# Altium schematic sheet MCU.SchDoc
size D; SheetNumber: 4; SheetTotal: 7
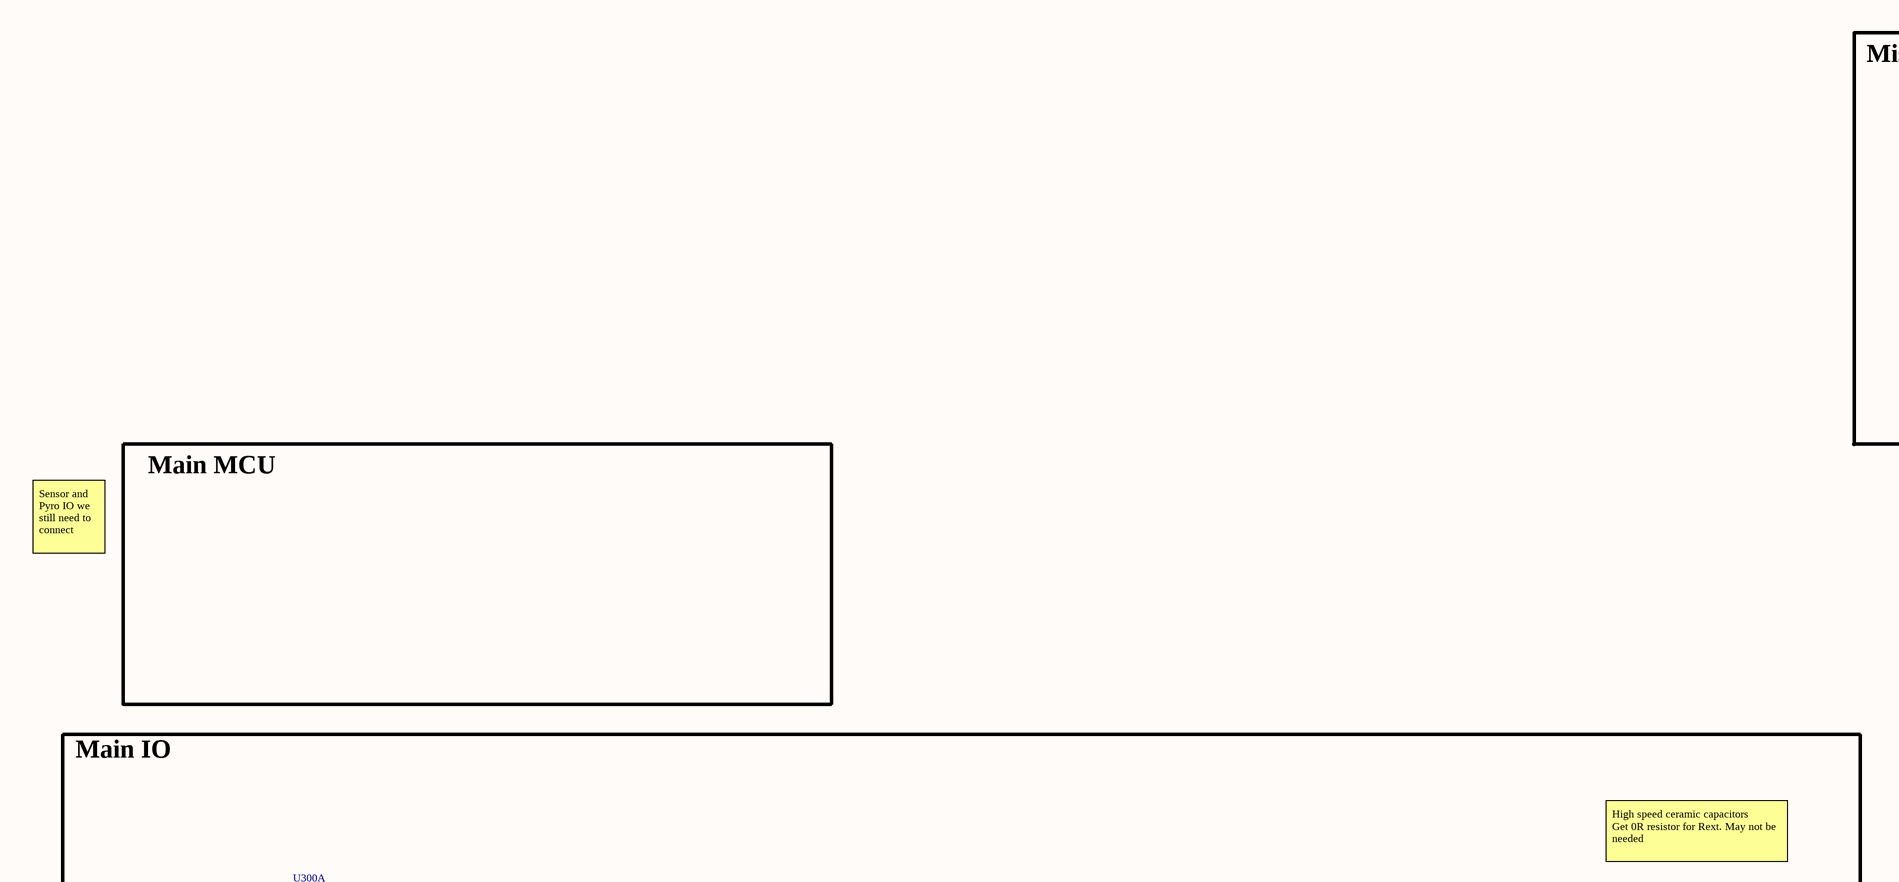
[diagram p0: MCU.SchDoc, top left]
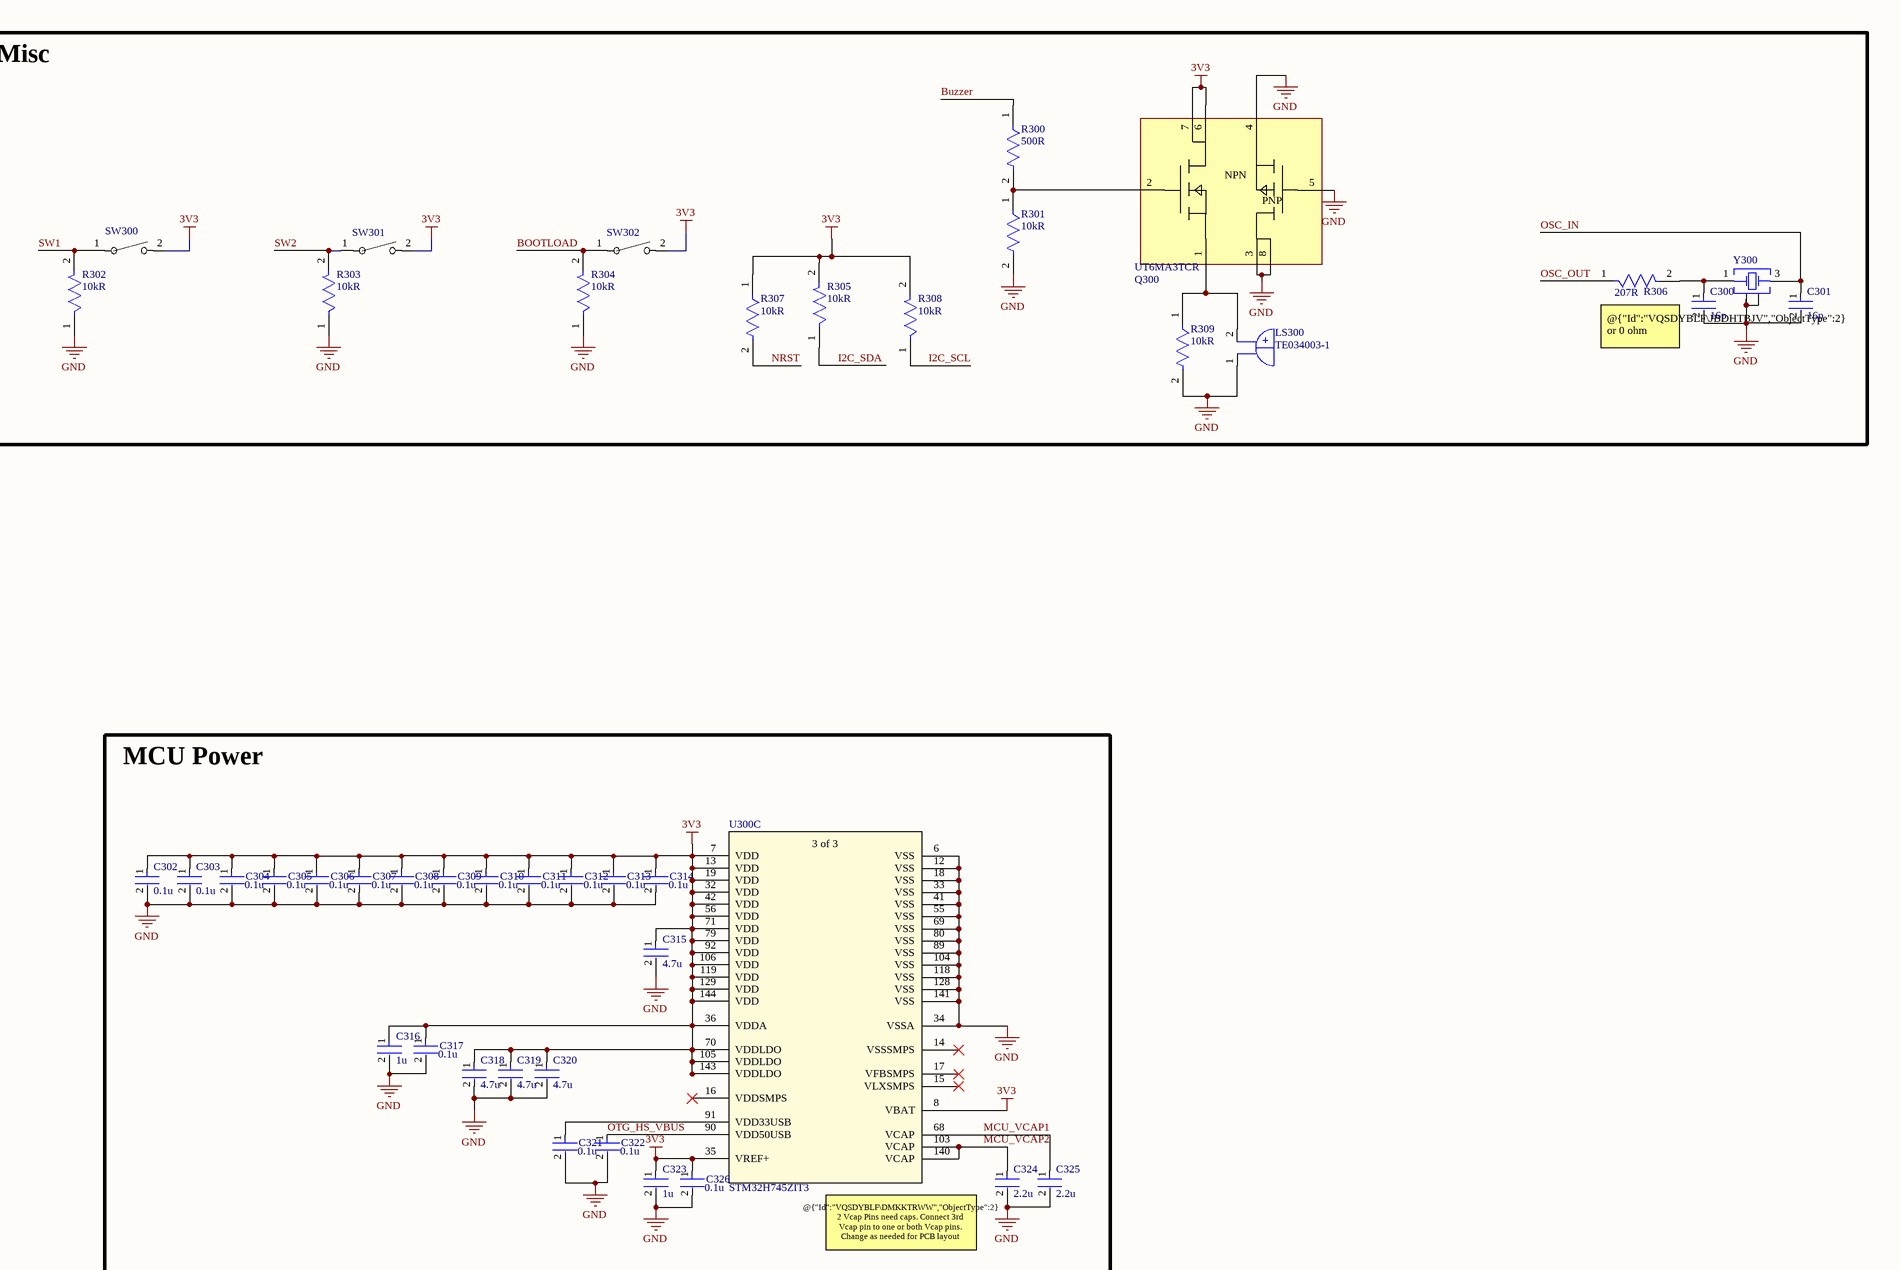
[diagram p1: MCU.SchDoc, top right]
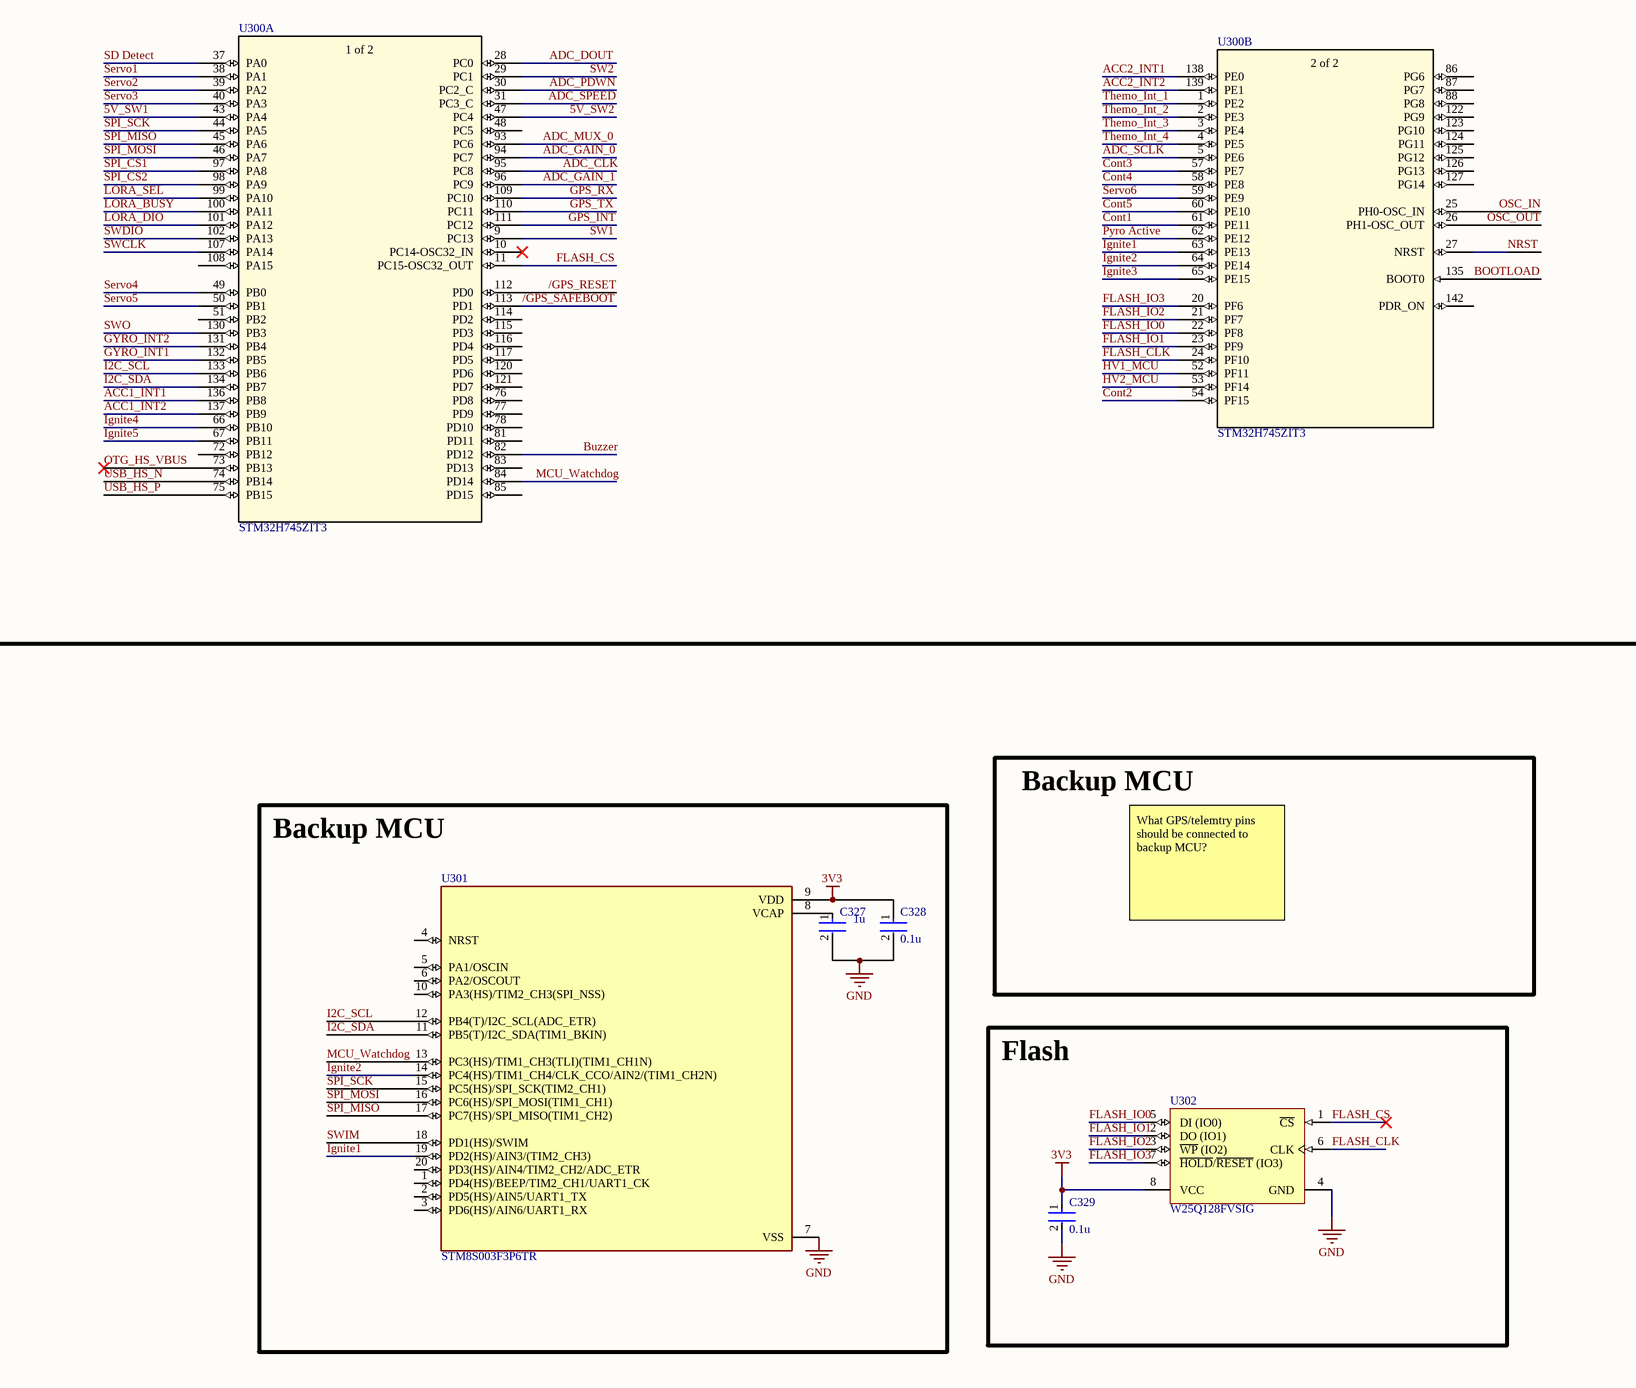
[diagram p2: MCU.SchDoc, bottom left]

## Parts
C300  Capacitance: 16p  [FP-CL10-IPC_A]  (hidden comment: CL10C681JB8NFNC)
C301  Capacitance: 16p  [FP-CL10-IPC_A]  (hidden comment: CL10C681JB8NFNC)
C302  Capacitance: 0.1u  [FP-CL94-IPC_C]  (hidden comment: CL05B104KQ5NNNC)
C303  Capacitance: 0.1u  [FP-CL94-IPC_C]  (hidden comment: CL05B104KQ5NNNC)
C304  Capacitance: 0.1u  [FP-CL94-IPC_C]  (hidden comment: CL05B104KQ5NNNC)
C305  Capacitance: 0.1u  [FP-CL94-IPC_C]  (hidden comment: CL05B104KQ5NNNC)
C306  Capacitance: 0.1u  [FP-CL94-IPC_C]  (hidden comment: CL05B104KQ5NNNC)
C307  Capacitance: 0.1u  [FP-CL94-IPC_C]  (hidden comment: CL05B104KQ5NNNC)
C308  Capacitance: 0.1u  [FP-CL94-IPC_C]  (hidden comment: CL05B104KQ5NNNC)
C309  Capacitance: 0.1u  [FP-CL94-IPC_C]  (hidden comment: CL05B104KQ5NNNC)
C310  Capacitance: 0.1u  [FP-CL94-IPC_C]  (hidden comment: CL05B104KQ5NNNC)
C311  Capacitance: 0.1u  [FP-CL94-IPC_C]  (hidden comment: CL05B104KQ5NNNC)
C312  Capacitance: 0.1u  [FP-CL94-IPC_C]  (hidden comment: CL05B104KQ5NNNC)
C313  Capacitance: 0.1u  [FP-CL94-IPC_C]  (hidden comment: CL05B104KQ5NNNC)
C314  Capacitance: 0.1u  [FP-CL94-IPC_C]  (hidden comment: CL05B104KQ5NNNC)
C315  Capacitance: 4.7u  [FP-CL10-IPC_A]  (hidden comment: CL10C681JB8NFNC)
C316  Capacitance: 1u  [FP-CL10-IPC_A]  (hidden comment: CL10C681JB8NFNC)
C317  Capacitance: 0.1u  [FP-CL94-IPC_C]  (hidden comment: CL05B104KQ5NNNC)
C318  Capacitance: 4.7u  [FP-CL10-IPC_A]  (hidden comment: CL10C681JB8NFNC)
C319  Capacitance: 4.7u  [FP-CL10-IPC_A]  (hidden comment: CL10C681JB8NFNC)
C320  Capacitance: 4.7u  [FP-CL10-IPC_A]  (hidden comment: CL10C681JB8NFNC)
C321  Capacitance: 0.1u  [FP-CL94-IPC_C]  (hidden comment: CL05B104KQ5NNNC)
C322  Capacitance: 0.1u  [FP-CL94-IPC_C]  (hidden comment: CL05B104KQ5NNNC)
C323  Capacitance: 1u  [FP-CL10-IPC_A]  (hidden comment: CL10C681JB8NFNC)
C324  Capacitance: 2.2u  [FP-CL10-IPC_A]  (hidden comment: CL10C681JB8NFNC)
C325  Capacitance: 2.2u  [FP-CL10-IPC_A]  (hidden comment: CL10C681JB8NFNC)
C326  Capacitance: 0.1u  [FP-CL94-IPC_C]  (hidden comment: CL05B104KQ5NNNC)
C327  Capacitance: 1u  [FP-CL10-IPC_A]  (hidden comment: CL10C681JB8NFNC)
C328  Capacitance: 0.1u  [FP-CL10-IPC_A]  (hidden comment: CL10C681JB8NFNC)
C329  Capacitance: 0.1u  [FP-CL10-IPC_A]  (hidden comment: CL10C681JB8NFNC)
LS300  TE034003-1  [XDCR_TE034003-1]
Q300  UT6MA3TCR  [TRANS_UT6J3_ROM]
R300  value 500R  [FP-CPF0603-MFG]  (hidden comment: CPF0603B2K15E1)
R301  value 10kR  [FP-CPF0603-MFG]  (hidden comment: CPF0603B2K15E1)
R302  value 10kR  [FP-CPF0603-MFG]  (hidden comment: CPF0603B2K15E1)
R303  value 10kR  [FP-CPF0603-MFG]  (hidden comment: CPF0603B2K15E1)
R304  value 10kR  [FP-CPF0603-MFG]  (hidden comment: CPF0603B2K15E1)
R305  value 10kR  [FP-CPF0603-MFG]  (hidden comment: CPF0603B2K15E1)
R306  value 207R  [FP-CPF0603-MFG]  (hidden comment: CPF0603B2K15E1)
R307  value 10kR  [FP-CPF0603-MFG]  (hidden comment: CPF0603B2K15E1)
R308  value 10kR  [FP-CPF0603-MFG]  (hidden comment: CPF0603B2K15E1)
R309  value 10kR  [FP-CPF0603-MFG]  (hidden comment: CPF0603B2K15E1)
SW300  PTS636SL43SMTRLFS  [SW_PTS636S-J_CNK]  (value not drawn)
SW301  PTS636SL43SMTRLFS  [SW_PTS636S-J_CNK]  (value not drawn)
SW302  PTS636SL43SMTRLFS  [SW_PTS636S-J_CNK]  (value not drawn)
U300  STM32H745ZIT3  [LQFP-144]  (parts A,B,C of 3)
U301  STM8S003F3P6TR  [SOP65P640X120-20N]
U302  W25Q128FVSIG  [WINB-SOIC-8_M]
Y300  830108213509  [WE-XTAL_IQXC-42]  (value not drawn)

## Blocks framed on the sheet
Misc: C300 C301 LS300 Q300 R300-R309 SW300-SW302 Y300
Main IO: U300
MCU Power: C302-C326 U300
Backup MCU: C327 C328 U301
Flash: C329 U302

## Nets
3V3: C302.1 C303.1 C304.1 C305.1 C306.1 C307.1 C308.1 C309.1 C310.1 C311.1 C312.1 C313.1 C314.1 C315.1 C316.1 C317.1 C318.1 C319.1 C320.1 C323.1 C326.1 C328.1 C329.1 Q300.6 Q300.7 R305.2 R307.1 R308.2 SW300.2 SW301.2 SW302.2 U300.7(VDD) U300.8(VBAT) U300.13(VDD) U300.19(VDD) U300.32(VDD) U300.35(VREF+) U300.36(VDDA) U300.42(VDD) U300.56(VDD) U300.70(VDDLDO) U300.71(VDD) U300.79(VDD) U300.92(VDD) U300.105(VDDLDO) U300.106(VDD) U300.119(VDD) U300.129(VDD) U300.143(VDDLDO) U300.144(VDD) U301.9(VDD) U302.8(VCC)
GND: C300.2 C301.2 C302.2 C303.2 C304.2 C305.2 C306.2 C307.2 C308.2 C309.2 C310.2 C311.2 C312.2 C313.2 C314.2 C315.2 C316.2 C317.2 C318.2 C319.2 C320.2 C321.2 C322.2 C323.2 C324.2 C325.2 C326.2 C327.2 C328.2 C329.2 LS300.1(NEG) Q300.3 Q300.4 Q300.5 Q300.8 R301.2 R302.1 R303.1 R304.1 R309.2 U300.6(VSS) U300.12(VSS) U300.18(VSS) U300.33(VSS) U300.34(VSSA) U300.41(VSS) U300.55(VSS) U300.69(VSS) U300.80(VSS) U300.89(VSS) U300.104(VSS) U300.118(VSS) U300.128(VSS) U300.141(VSS) U301.7(VSS) U302.4(GND) Y300.2(GND) Y300.4(GND)
5V_SW1: U300.43(PA4)
5V_SW2: U300.47(PC4)
/GPS_RESET: U300.112(PD0)
/GPS_SAFEBOOT: U300.113(PD1)
ACC1_INT1: U300.136(PB8)
ACC1_INT2: U300.137(PB9)
ACC2_INT1: U300.138(PE0)
ACC2_INT2: U300.139(PE1)
ADC_CLK: U300.95(PC8)
ADC_DOUT: U300.28(PC0)
ADC_GAIN_0: U300.94(PC7)
ADC_GAIN_1: U300.96(PC9)
ADC_MUX_0: U300.93(PC6)
ADC_PDWN: U300.30(PC2_C)
ADC_SCLK: U300.5(PE6)
ADC_SPEED: U300.31(PC3_C)
BOOTLOAD: R304.2 SW302.1 U300.135(BOOT0)
Buzzer: R300.1 U300.82(PD12)
Cont1: U300.61(PE11)
Cont2: U300.54(PF15)
Cont3: U300.57(PE7)
Cont4: U300.58(PE8)
Cont5: U300.60(PE10)
FLASH_CLK: U300.24(PF10) U302.6(CLK)
FLASH_CS: U300.11(PC15-OSC32_OUT) U302.1(~{CS})
FLASH_IO0: U300.22(PF8) U302.5(DI_(IO0))
FLASH_IO1: U300.23(PF9) U302.2(DO_(IO1))
FLASH_IO2: U300.21(PF7) U302.3(~{WP}_(IO2))
FLASH_IO3: U300.20(PF6) U302.7(~{HOLD}/~{RESET}_(IO3))
GPS_INT: U300.111(PC12)
GPS_RX: U300.109(PC10)
GPS_TX: U300.110(PC11)
GYRO_INT1: U300.132(PB5)
GYRO_INT2: U300.131(PB4)
HV1_MCU: U300.52(PF11)
HV2_MCU: U300.53(PF14)
I2C_SCL: R308.1 U300.133(PB6) U301.12(PB4(T)/I2C_SCL(ADC_ETR))
I2C_SDA: R305.1 U300.134(PB7) U301.11(PB5(T)/I2C_SDA(TIM1_BKIN))
Ignite1: U300.63(PE13) U301.19(PD2(HS)/AIN3/(TIM2_CH3))
Ignite2: U300.64(PE14) U301.14(PC4(HS)/TIM1_CH4/CLK_CCO/AIN2/(TIM1_CH2N))
Ignite3: U300.65(PE15)
Ignite4: U300.66(PB10)
Ignite5: U300.67(PB11)
LORA_BUSY: U300.100(PA11)
LORA_DIO: U300.101(PA12)
LORA_SEL: U300.99(PA10)
MCU_VCAP1: C325.1 U300.68(VCAP)
MCU_VCAP2: C324.1 U300.103(VCAP) U300.140(VCAP)
MCU_Watchdog: U300.84(PD14) U301.13(PC3(HS)/TIM1_CH3(TLI)(TIM1_CH1N))
NRST: R307.2 U300.27(NRST)
OSC_IN: C301.1 U300.25(PH0-OSC_IN) Y300.3(Crystal)
OSC_OUT: R306.1 U300.26(PH1-OSC_OUT)
OTG_HS_VBUS: C322.1 U300.73(PB13) U300.90(VDD50USB)
Pyro Active: U300.62(PE12)
SD Detect: U300.37(PA0)
Servo1: U300.38(PA1)
Servo2: U300.39(PA2)
Servo3: U300.40(PA3)
Servo4: U300.49(PB0)
Servo5: U300.50(PB1)
Servo6: U300.59(PE9)
SPI_CS1: U300.97(PA8)
SPI_CS2: U300.98(PA9)
SPI_MISO: U300.45(PA6) U301.17(PC7(HS)/SPI_MISO(TIM1_CH2))
SPI_MOSI: U300.46(PA7) U301.16(PC6(HS)/SPI_MOSI(TIM1_CH1))
SPI_SCK: U300.44(PA5) U301.15(PC5(HS)/SPI_SCK(TIM2_CH1))
SW1: R302.2 SW300.1 U300.9(PC13)
SW2: R303.2 SW301.1 U300.29(PC1)
SWCLK: U300.107(PA14)
SWDIO: U300.102(PA13)
SWIM: U301.18(PD1(HS)/SWIM)
SWO: U300.130(PB3)
Themo_Int_1: U300.1(PE2)
Themo_Int_2: U300.2(PE3)
Themo_Int_3: U300.3(PE4)
Themo_Int_4: U300.4(PE5)
USB_HS_N: U300.74(PB14)
USB_HS_P: U300.75(PB15)
NetC300_1: C300.1 R306.2 Y300.1(Crystal)
NetC321_1: C321.1 U300.91(VDD33USB)
NetC327_1: C327.1 U301.8(VCAP)
NetLS300_2: LS300.2(POS) Q300.1 R309.1
NetQ300_2: Q300.2 R300.2 R301.1

Not connected (* = marked no-connect by the designer): U300 10(PC14-OSC32_IN)* 14(VSSSMPS)* 15(VLXSMPS)* 16(VDDSMPS)* 17(VFBSMPS)* 48(PC5) 51(PB2) 72(PB12) 76(PD8) 77(PD9) 78(PD10) 81(PD11) 83(PD13) 85(PD15) 86(PG6) 87(PG7) 88(PG8) 108(PA15) 114(PD2) 115(PD3) 116(PD4) 117(PD5) 120(PD6) 121(PD7) 122(PG9) 123(PG10) 124(PG11) 125(PG12) 126(PG13) 127(PG14) 142(PDR_ON); U301 1(PD4(HS)/BEEP/TIM2_CH1/UART1_CK) 2(PD5(HS)/AIN5/UART1_TX) 3(PD6(HS)/AIN6/UART1_RX) 4(NRST) 5(PA1/OSCIN) 6(PA2/OSCOUT) 10(PA3(HS)/TIM2_CH3(SPI_NSS)) 20(PD3(HS)/AIN4/TIM2_CH2/ADC_ETR)

## Notes on the sheet
- @{"Id":"VQSDYBLF\JBDHTBJV","ObjectType":2} or 0 ohm
- Main MCU
- Sensor and Pyro IO we still need to connect
- High speed ceramic capacitors
  Get 0R resistor for Rext. May not be needed
- @{"Id":"VQSDYBLF\DMKKTRWW","ObjectType":2}
  2 Vcap Pins need caps. Connect 3rd Vcap pin to one or both Vcap pins.
  Change as needed for PCB layout
- Backup MCU
- What GPS/telemtry pins should be connected to backup MCU?
- (in symbol CMP-009-00178-3) NPN; PNP
- (in symbol CMP-028-000001-2, part A) 1 of 2
- (in symbol CMP-028-000001-2, part B) 2 of 2
- (in symbol CMP-028-000001-2, part C) 3 of 3

## Library data of the parts
C300 C301 C315 C316 C318-C320 C323-C325 = CMP-13271-001533-1: Cap Ceramic 680pF 50V C0G ±5% Pad SMD 0603 +125°C T/R; Voltage Rating: 50V; Radiation Hardening: No; Length: 0.063inch; Min Operating Temperature: -55°C; Package Quantity: 1; Lead Free: Lead Free; Case Code (Metric): 1608; Thickness: 0.035inch; Width: 0.031inch; Height: 0.8mm; Case/Package: 0603; Tolerance: 5%; Mount: Surface Mount; Dielectric: C0G; Max Operating Temperature: 125°C; Case Code (Imperial): 0603; Packaging: Tape and Reel; Depth: 0.8mm
C302-C314 C317 C321 C322 C326 = CMP-13271-000088-1: Cap Ceramic 100nF 6.3V X7R ±10% SMD 0402 +125°C Paper T/R; Tolerance: 10%; Thickness: 0.022inch; Case Code (Metric): 1005; Dielectric: X7R; Case/Package: 0402; Min Operating Temperature: -55°C; Voltage Rating (DC): 6.3V; Radiation Hardening: No; Voltage Rating: 6.3V; Depth: 0.5mm; Length: 1mm; Case Code (Imperial): 0402; Mount: Surface Mount; Width: 0.02inch; Height: 0.5mm; Max Operating Temperature: 125°C; Lead Free: Lead Free; Packaging: Tape and Reel
C327-C329 = CMP-13271-001533-1: Cap Ceramic 680pF 50V C0G ±5% Pad SMD 0603 +125°C T/R; Dielectric: X7R; Voltage Rating: 50V; Radiation Hardening: No; Length: 0.063inch; Min Operating Temperature: -55°C; Package Quantity: 1; Lead Free: Lead Free; Case Code (Metric): 1608; Thickness: 0.035inch; Width: 0.031inch; Height: 0.8mm; Case/Package: 0603; Tolerance: 5%; Mount: Surface Mount; Max Operating Temperature: 125°C; Case Code (Imperial): 0603; Packaging: Tape and Reel; Depth: 0.8mm
LS300 = CMP-141-000000-1: Buzzers Transducer, Externally Driven Electromechanical 3 V 120mA 4kHz 64dB @ 3V, 10cm Surface Mount Solder Pads; MF: DB Unlimited; Package: DB Unlimited; Pin Count: 2; MP: TE034003-1; Design Item ID: TE034003-1; Check_prices: https://www.snapeda.com/parts/TE034003-1/DB+Unlimited/view-part/?ref=eda; Component Type: Standard; Value: *; SnapEDA_Link: https://www.snapeda.com/parts/TE034003-1/DB+Unlimited/view-part/?ref=snap; Source: TE034003-1.SchLib
Q300 = CMP-009-00178-3: No Description Available; Mfr_Name: ROHM Semiconductor; Type: Type; Design Item ID: UT6MA3TCR; RefDes: RefDes; Source: UT6MA3TCR.SchLib
R300-R309 = CMP-03211-008657-1: RES SMD 2.15KΩ 0.1% 1/16W 0603; Manufacturer: TE Connectivity; Temperature Coefficient: 25ppm/°C; Voltage Rating: 50V; Power Rating: 0.063W; Height: 0.55mm; Series: CPF; ComponentLink2Description: Datasheet; Package: CPF0603; Automotive: No; octopart_url: https://octopart.com/cpf0603b2k15e1-te+connectivity-22739551; Lead Free: Yes; Temperature: -55°C to +155°C; RoHS: TRUE; Ipc Land Pattern Name: RESC15580X45; Temperature Range Low: -55°C; Composition: Thin Film; Device Class L3: Chip SMD Resistors; Category: Res; Octopart: https://octopart.com/cpf0603b2k15e1-te+connectivity-22739551; Resistance: 2.15KΩ; ComponentLink2URL: https://www.te.com/commerce/DocumentDelivery/DDEController?Action=showdoc&DocId=Data+Sheet%7F1773200%7FM%7Fpdf%7FEnglish%7FENG_DS_1773200_M.pdf%7F3-1676481-2; Manufacturer Part Number: CPF0603B2K15E1; packaging: 1k Reel; Tolerance: 0.1%; Temperature Range High: +155°C; Device Class L1: Passive Components; Device Class L2: Resistors
SW300-SW302 = CMP-011-00042-1: No Description Available; Mfr_Name: C&K Components; Digi-Key_Part_Number_1: CKN12309-2-ND; Digi-Key_Part_Number_2: CKN12309-1-ND; Design Item ID: PTS636SL43SMTRLFS; Source: PTS636SL43SMTRLFS.SchLib; Type: Tactile Switches; Digi-Key_Part_Number_3: CKN12309-6-ND
U300 = CMP-028-000001-2: 32-bit Dual Core, 144 Pin, 97 IO, 1M RAM, 2M Flash; Mfr_Name: STMicroelectronics; RefDes: RefDes; Design Item ID: STM32H745ZIT3; Type: Type; RoHS Compliant: Yes; Source: STM32H745ZIT3.SchLib; PartId: 1
U301 = CMP-031-00008-2: STM8 STM8S Microcontroller IC 8-Bit 16MHz 8KB (8K x 8) FLASH 20-TSSOP; MF: STMicroelectronics; MP: STM8S003F3P6TR; Source: STM8S003F3P6TR.SchLib; Value: *; Case/Package: TSSOP-20 STMicroelectronics; Availability: Good; SnapEDA_Link: https://www.snapeda.com/parts/STM8S003F3P6TR/STMicroelectronics/view-part/214129/?ref=snap; Price: None; Design Item ID: STM8S003F3P6TR; Purchase-URL: https://pricing.snapeda.com/search/part/STM8S003F3P6TR/?ref=eda
U302 = CMP-2000-05005-1: 3V 128M-Bit Serial Flash Memory with Dual/Quad SPI & QPI, 2.7 to 3.6 V, -40 to 85 degC, 8-Pin SOIC, RoHS, Tape and Reel; Manufacturer: Winbond; Number of Words: 16777216; Address Bus: 24b; Word Size: 8b; Boot Type: NotRequired; Supply Current: 20mA; Operating Supply Voltage (Max): 3.6V; Sync/Async: Synchronous; Rad Hardened: No; Interface Type: Serial(SPI); Access Time (Max): 7ns; Operating Supply Voltage (Min): 2.7V; Operating Supply Voltage (Typ): 3/3.3V; Programmable: Yes; Density: 134217728Bit; Cell Type: NOR; Package Description: 8-Pin Small Outline Integrated Circuit, Body 5.28 x 5.28 mm, Pitch 1.27 mm; Datasheet URL: http://download.siliconexpert.com/pdfs/2015/11/30/6/42/17/890/win_/manual/3w25q128fv20rev.l2008242015.pdf; Package Reference: SS-8; Package Type: SOICW; Datasheet Version: Rev. L, 08/2015; Manufacturer URL: http://www.winbond.com/hq/index.html?__locale=en; Pin Count: 8; Operating Temperature Classification: Industrial; Operating Temperature (Min): -40C; Program/Erase Volt (Typ): 2.7to3.6V; Operating Temperature (Max): 85C; Mounting: SurfaceMount; Operating Temp Range: -40Cto85C
Y300 = CMP-003-00030-1: WE-XTAL Quartz Crystal, SMT, IQXC-42, 48MHz, +/-10ppm; Manufacturer: Wurth Elektronik; Load Capacitance: 8pF; Frequency Stability: +/-15ppm; ComponentLink1Description: Website Link; Length: 2mm; Match Code: WE-XTAL; Frequency Tolerance: +/-10ppm; Packaging: Tape and Reel; ComponentLink2Description: Datasheet Link; Case/Package: IQXC-42; Source: WE-XTAL.SchLib; Width: 1.6mm; Manufacturer Part Number: 830108213509; Operating Temperature Max: 85°C; Frequency: 48MHz; Pins: 4; Category: Crystals; Height: 0.5mm; ComponentLink2URL: https://www.we-online.com/redexpert/spec/830108213509?ad; ComponentLink1URL: https://www.we-online.com/redexpert/article/830108213509?ad; Operating Temperature Min: -40°C; Component Type: Standard; Design Item ID: 830108213509; Mount: Surface Mount